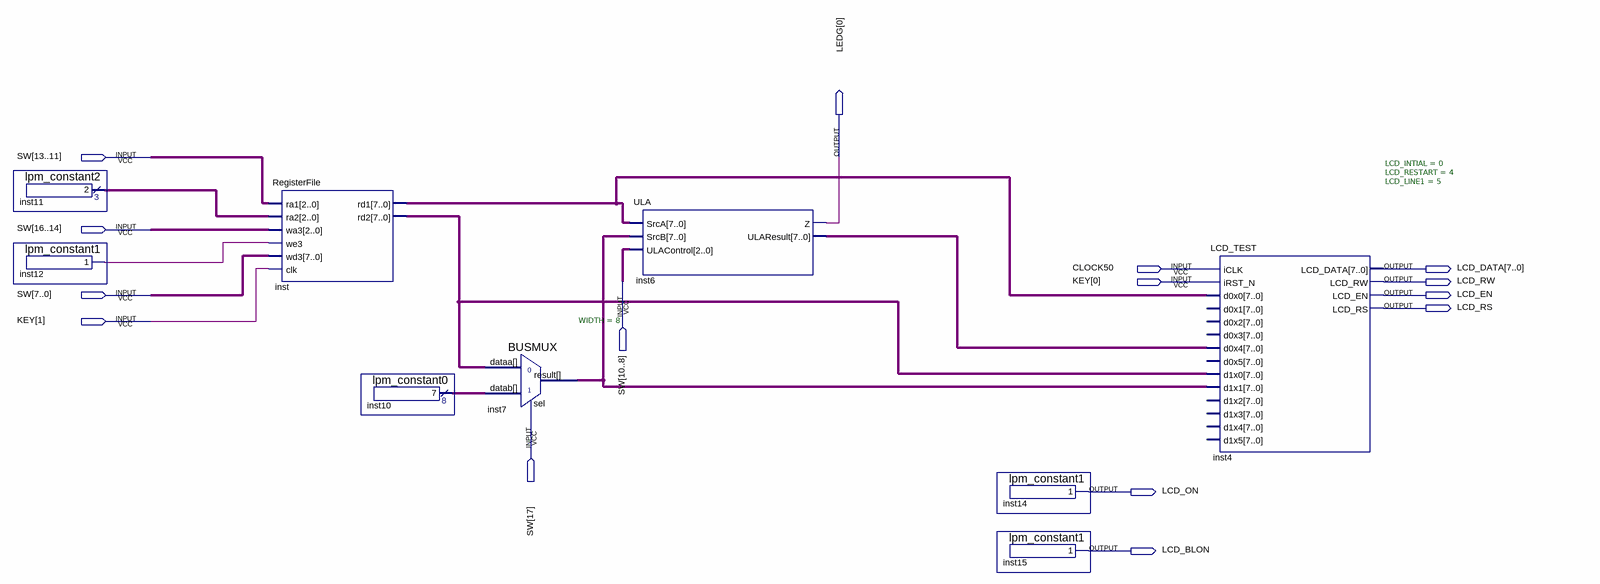
[diagram p0: schematic sheet]
// Quartus schematic Schematic.bdf as structural Verilog: 9 symbols, 15 pins
module Schematic (
  input  [17:0] SW,
  input  CLOCK50,
  input  [1:0] KEY,
  output [0:0] LEDG,
  output [7:0] LCD_DATA,
  output LCD_RW,
  output LCD_EN,
  output LCD_RS,
  output LCD_ON,
  output LCD_BLON
);

  wire inst12_result;
  wire [2:0] inst11_result;
  wire [7:0] inst6_ularesult, inst7_result, inst10_result, inst_rd1, inst_rd2;

  lpm_constant2 inst11 (.result(inst11_result));
  lpm_constant1 inst12 (.result(inst12_result));
  RegisterFile inst (
    .ra1(SW[13:11]), .ra2(inst11_result), .wa3(SW[16:14]), .we3(inst12_result), .wd3(SW[7:0]), .clk(KEY[1]),
    .rd1(inst_rd1), .rd2(inst_rd2));
  lpm_constant0 inst10 (.result(inst10_result));
  BUSMUX #(.WIDTH(8)) inst7 (.datab(inst10_result), .sel(SW[17]), .dataa(inst_rd2), .result(inst7_result));
  ULA inst6 (.SrcA(inst_rd1), .SrcB(inst7_result), .ULAControl(SW[10:8]), .Z(LEDG[0]), .ULAResult(inst6_ularesult));
  lpm_constant1 inst14 (.result(LCD_ON));
  lpm_constant1 inst15 (.result(LCD_BLON));
  LCD_TEST #(.LCD_INTIAL(0), .LCD_RESTART(4), .LCD_LINE1(5)) inst4 (
    .iCLK(CLOCK50), .iRST_N(KEY[0]), .d0x0(inst_rd1), .d0x4(inst6_ularesult), .d1x0(inst_rd2),
    .d1x1(inst7_result), .LCD_DATA(LCD_DATA), .LCD_RW(LCD_RW), .LCD_EN(LCD_EN), .LCD_RS(LCD_RS));  // open: d0x1, d0x2, d0x3, d0x5, d1x2, d1x3, d1x4, d1x5
endmodule
